# EAGLE design a-star_dual_drv8801_stapler (EAGLE 7.1.0)
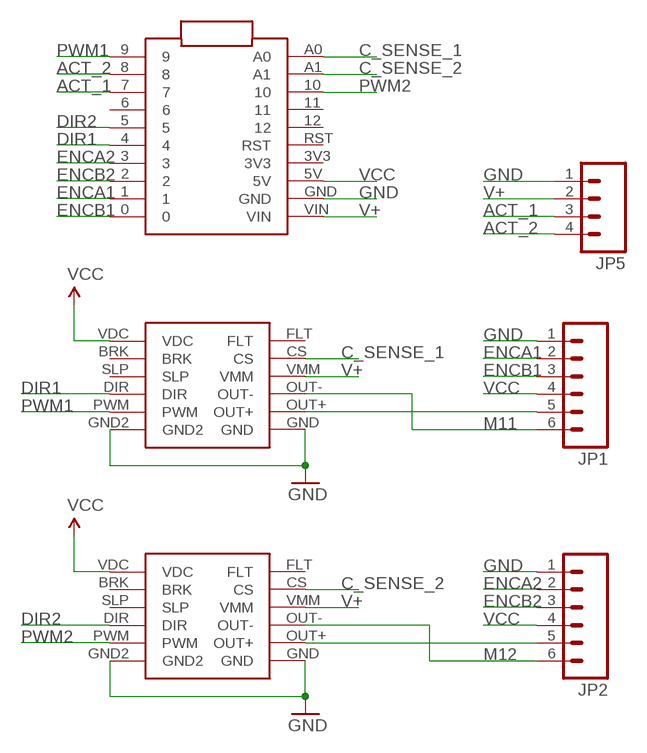
[diagram p0: schematic, sheet 1]

## Parts
JP1  M06POLAR  [MOLEX-1X6]
JP2  M06POLAR  [MOLEX-1X6]
JP5  M04POLAR  [MOLEX-1X4]
U$1  POLOLU_DRV8801_CARRIER  [POLOLU_DRV8801_CARRIER]
U$2  POLOLU_A-STAR-MICRO  [POLOLU_A-STAR-MICRO]
U$3  POLOLU_DRV8801_CARRIER  [POLOLU_DRV8801_CARRIER]

## Nets
ACT_1: JP5.3 U$2.7
ACT_2: JP5.4 U$2.8
C_SENSE_1: U$1.CS U$2.A0
C_SENSE_2: U$2.A1 U$3.CS
DIR1: U$1.DIR U$2.4
DIR2: U$2.5 U$3.DIR
ENCA1: JP1.2 U$2.1
ENCA2: JP2.2 U$2.3
ENCB1: JP1.3 U$2.0
ENCB2: JP2.3 U$2.2
GND: JP1.1 JP2.1 JP5.1 U$1.GND U$1.GND2 U$2.GND U$3.GND U$3.GND2
M11: JP1.6 U$1.OUT-
M12: JP2.6 U$3.OUT-
N$2: JP2.5 U$3.OUT+
N$4: JP1.5 U$1.OUT+
PWM1: U$1.PWM U$2.9
PWM2: U$2.10 U$3.PWM
V+: JP5.2 U$1.VMM U$2.VIN U$3.VMM
VCC: JP1.4 JP2.4 U$1.VDC U$2.5V U$3.VDC
Unconnected: U$1.BRK U$1.FLT U$1.SLP U$2.3V3 U$2.6 U$2.11 U$2.12 U$2.RST U$3.BRK U$3.FLT U$3.SLP

## Library data of the parts
JP1 JP2 = SparkFun:M06: Header 6 Standard 6-pin 0.1" header. Use with straight break away headers (SKU : PRT-00116), right angle break away headers (PRT-00553), swiss pins (PRT-00743), machine pins (PRT-00117), and female headers (PRT-00115). Molex polarized connector foot print use with SKU : PRT-08094 with associated crimp pins and housings. NOTES ON THE VARIANTS LOCK and LOCK_LONGPADS... This footprint was designed to help hold the alignment of a through-hole component (i.e. 6-pin header) while soldering it into place. You may notice that each hole has been shifted either up or down by 0.005 of an inch from it's more standard position (which is a perfectly straight line). This slight alteration caused the pins (the squares in the middle) to touch the edges of the holes. Because they are alternating, it causes a "brace" to hold the component in place. 0.005 has proven to be the perfect amount of "off-center" position when using our standard breakaway headers. Although looks a little odd when you look at the bare footprint, once you have a header in there, the alteration is very hard to notice. Also, if you push a header all the way into place, it is covered up entirely on the bottom side. This idea of altering the position of holes to aid alignment will be further integrated into the Sparkfun Library for other footprints. It can help hold any component with 3 or more connection pins.
JP5 = SparkFun:M04: Header 4 Standard 4-pin 0.1" header. Use with straight break away headers (SKU : PRT-00116), right angle break away headers (PRT-00553), swiss pins (PRT-00743), machine pins (PRT-00117), and female headers (PRT-00115). Molex polarized connector foot print use with SKU : PRT-08231 with associated crimp pins and housings.
U$1 U$3 = will:POLOLU_DRV8801_CARRIER
U$2 = will:POLOLU_A-STAR-MICRO

## Board
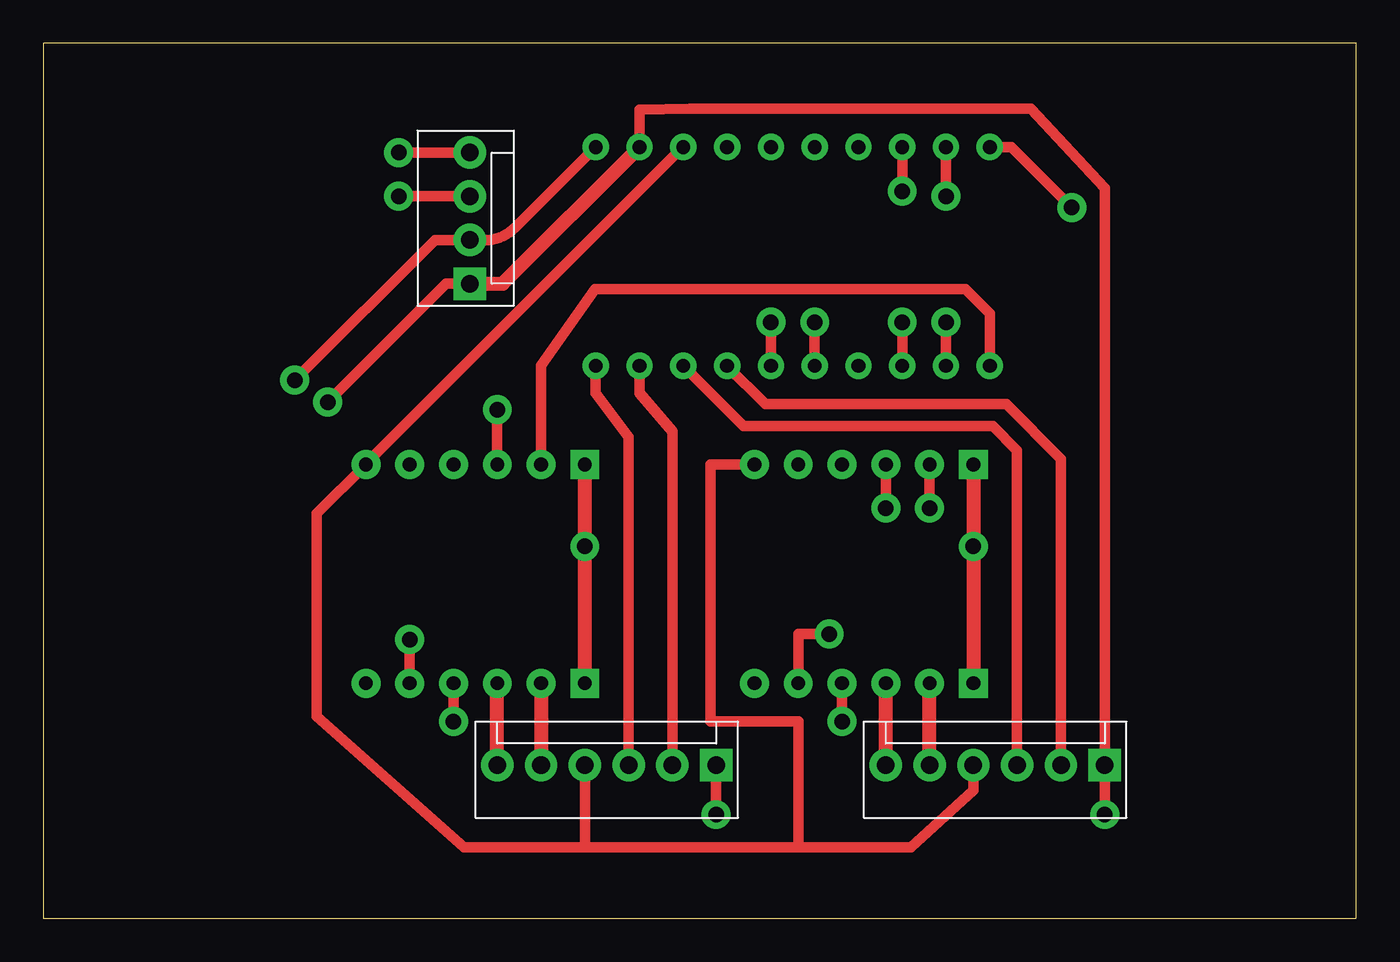
[diagram p1: board, top side]
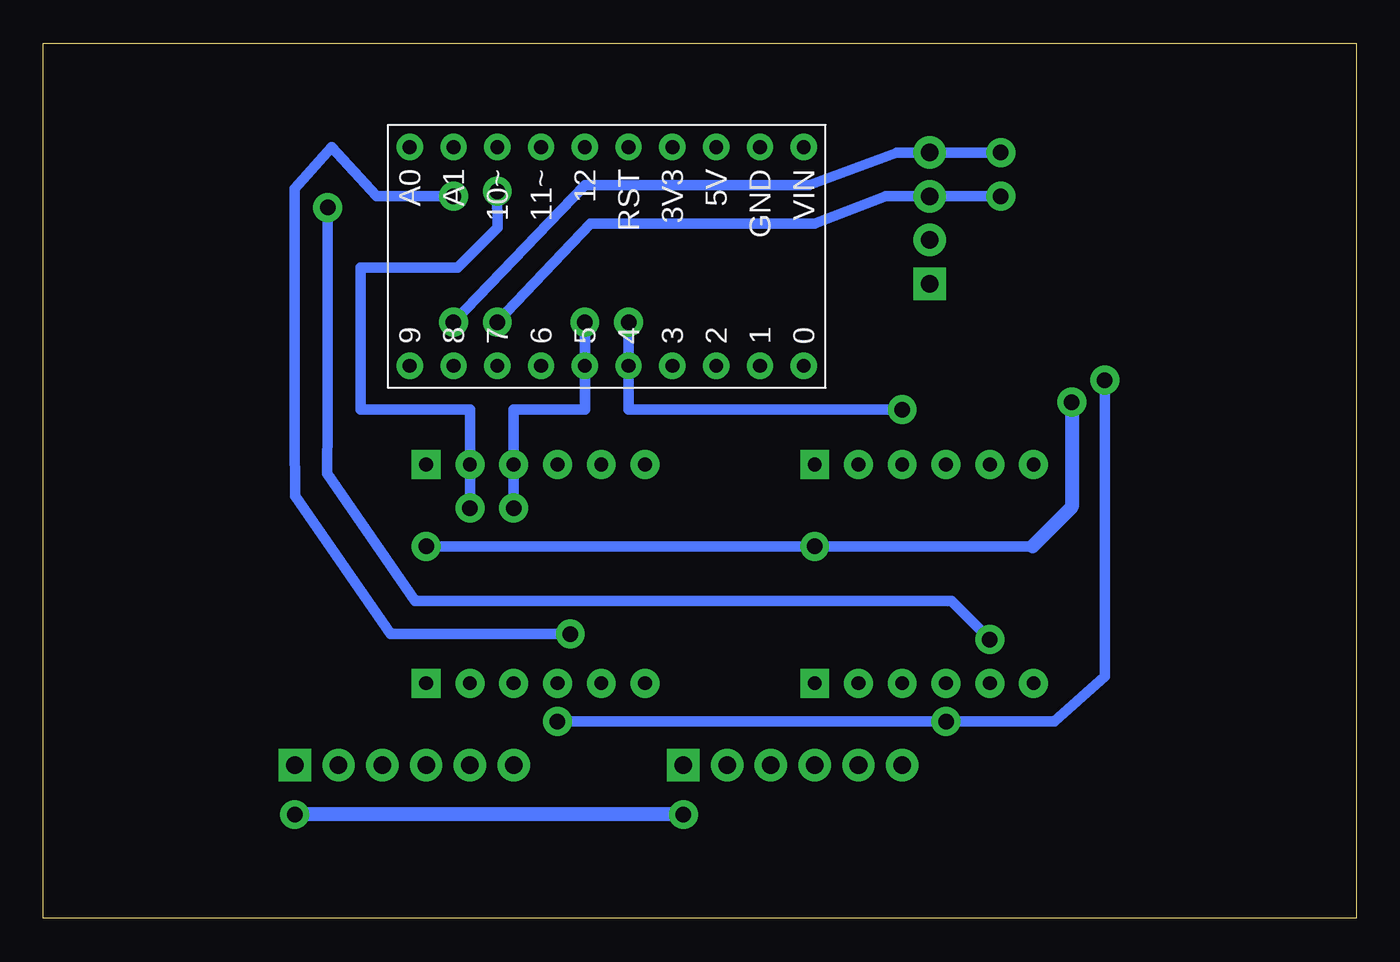
[diagram p2: board, bottom side, seen from below]

Size 76.2 x 50.8 mm. Coordinates in mm from the lower left corner, seen from the top.
Outline: 0,0 76.2,0 76.2,50.8 0,50.8 0,0
Copper layers (1*16): Top 0.035mm / dielectric 1.5mm / Bottom 0.035mm
Design rules "fab *": minimum track width 0.3mm, minimum drill 32mil, track to track 0.4mm, track to pad 0.4mm, pad to pad 0.4mm, via to via 0.4mm, smd to smd 0.4mm, copper to edge 40mil, drill to drill 16mil, minimum pad ring 10mil, minimum via ring 8mil, stop-mask expansion 4mil, vias tented up to drill 0mil, thermal gap 10mil
Milling: area 0,0 to 76.2,50.8

### Footprints (pad centres in the part's own frame; a part is rotated, then mirrored left to right if it is on the bottom)
MOLEX-1X6 = drill 1.016 pad 1.88 square: 1 0,0 | drill 1.016 pad 1.88: 2 2.54,0; 3 5.08,0; 4 7.62,0; 5 10.16,0; 6 12.7,0
MOLEX-1X4 = drill 1.016 pad 1.88 square: 1 0,0 | drill 1.016 pad 1.88: 2 2.54,0; 3 5.08,0; 4 7.62,0
POLOLU_DRV8801_CARRIER = drill 0.8 pad 1.676: BRK -6.35,3.81; CS 6.35,3.81; DIR -6.35,-1.27; FLT 6.35,6.35; OUT+ 6.35,-3.81; OUT- 6.35,-1.27; PWM -6.35,-3.81; SLP -6.35,1.27; VDC -6.35,6.35; VMM 6.35,1.27 | drill 0.8 pad 1.676 square: GND 6.35,-6.35; GND2 -6.35,-6.35
POLOLU_A-STAR-MICRO = drill 0.8 pad 1.524: 0 -6.35,-12.7; 1 -6.35,-10.16; 2 -6.35,-7.62; 3 -6.35,-5.08; 3V3 6.35,-5.08; 4 -6.35,-2.54; 5 -6.35,0; 5V 6.35,-7.62; 6 -6.35,2.54; 7 -6.35,5.08; 8 -6.35,7.62; 9 -6.35,10.16; 10 6.35,5.08; 11 6.35,2.54; 12 6.35,0; A0 6.35,10.16; A1 6.35,7.62; GND 6.35,-10.16; RST 6.35,-2.54; VIN 6.35,-12.7

### Placement (x,y rotation side)
JP1  39.05,8.89 180 top
JP2  61.59,8.89 180 top
JP5  24.77,36.83 90 top
U$1  25.08,20 270 bottom
U$2  44.77,38.42 90 bottom
U$3  47.62,20 270 bottom

### Tracks (layer width: path | path; a pad name or v marks a point on that pad's centre or on a via)
ACT_1  (via drill 0.9 pad 1.68)
  Top 0.61: v49.85,34.61 U$2.7 | JP5.3 v20.64,41.91
  Bottom 0.61: v20.64,41.91 27.3,41.91 31.43,40.32 44.45,40.32 v49.85,34.61
ACT_2  (via drill 0.9 pad 1.68)
  Top 0.61: JP5.4 v20.64,44.45 | v52.39,34.61 U$2.8
  Bottom 0.61: v20.64,44.45 26.67,44.45 31.75,42.55 44.77,42.55 v52.39,34.61
C_SENSE_1  (via drill 0.9 pad 1.68)
  Top 0.61: v21.27,16.19 U$1.CS | U$2.A0 56.18,44.77 v59.69,41.26
  Bottom 0.61: v59.69,41.26 59.69,28.77 59.72,25.83 54.61,18.41 23.5,18.41 v21.27,16.19
C_SENSE_2  (via drill 0.9 pad 1.68)
  Top 0.61: U$2.A1 v52.39,41.91 | U$3.CS 43.81,16.51 v45.61,16.51
  Bottom 0.61: v52.39,41.91 56.85,41.91 59.46,44.77 61.59,42.34 61.59,28.03 61.57,24.51 56.05,16.51 v45.61,16.51
DIR1  (via drill 0.9 pad 1.68)
  Top 0.61: U$1.DIR v26.35,29.53 | v42.23,34.61 U$2.4
  Bottom 0.61: v26.35,29.53 42.23,29.53 v42.23,34.61
DIR2  (via drill 0.9 pad 1.68)
  Top 0.61: U$3.DIR v48.9,23.81 | v44.77,34.61 U$2.5
  Bottom 0.61: v48.9,23.81 48.9,29.53 44.77,29.53 v44.77,34.61
ENCA1
  Top 0.61: JP1.2 36.51,28.26 34.61,30.48 U$2.1
ENCA2
  Top 0.61: JP2.2 59.05,26.67 55.88,29.84 41.91,29.84 U$2.3
ENCB1
  Top 0.61: JP1.3 33.97,27.94 32.07,30.48 U$2.0
ENCB2
  Top 0.61: JP2.3 56.52,27.16 55.09,28.57 40.64,28.57 U$2.2
GND  (via drill 0.9 pad 1.68)
  Top 0.61: JP5.1 23.38,36.83 v16.51,29.96 | JP1.1 v39.05,6.03 | v61.59,6.03 JP2.1 61.59,42.38 57.3,46.99 37.53,46.99 34.61,46.92 U$2.GND
  Top 0.813: U$1.GND v31.43,21.59 U$1.GND2 | U$2.GND 26.67,36.83 JP5.1 | U$3.GND2 v53.98,21.59 U$3.GND
  Bottom 0.61: 18.8,21.59 v31.43,21.59 v53.98,21.59
  Bottom 0.813: v39.05,6.03 v61.59,6.03 | v16.51,29.96 16.51,23.88 18.8,21.59
M11
  Top 0.813: JP1.6 U$1.OUT-
M12
  Top 0.813: JP2.6 U$3.OUT-
N$2
  Top 0.813: JP2.5 U$3.OUT+
N$4
  Top 0.813: U$1.OUT+ JP1.5
PWM1
  Top 0.61: U$1.PWM 28.89,32.1 32.04,36.51 53.51,36.51 54.93,35.09 U$2.9
PWM2  (via drill 0.9 pad 1.68)
  Top 0.61: v49.85,42.2 U$2.10 | v51.44,23.81 U$3.PWM
  Bottom 0.61: v49.85,42.2 49.84,40.1 52.15,37.78 57.78,37.78 57.78,29.53 51.44,29.53 v51.44,23.81
V+  (via drill 0.9 pad 1.68)
  Top 0.61: v14.61,31.24 22.74,39.37 JP5.2 25.62,39.37 arc45 27.41,40.11 U$2.VIN | U$1.VMM v23.81,11.43 | U$3.VMM v46.35,11.43
  Bottom 0.61: v46.35,11.43 v23.81,11.43 17.53,11.43 14.61,14.04 v14.61,31.24
VCC
  Top 0.61: JP1.4 31.43,4.13 | 31.43,4.13 43.81,4.13 | 43.81,4.13 50.35,4.13 53.98,7.43 JP2.4 | 31.43,4.13 24.44,4.13 15.88,11.74 15.88,23.5 U$1.VDC 18.73,26.41 37.15,44.83 U$2.5V | U$3.VDC 38.73,26.35 38.73,11.43 43.81,11.43 43.81,4.13